# EAGLE schematic led_remote (EAGLE 6.1)
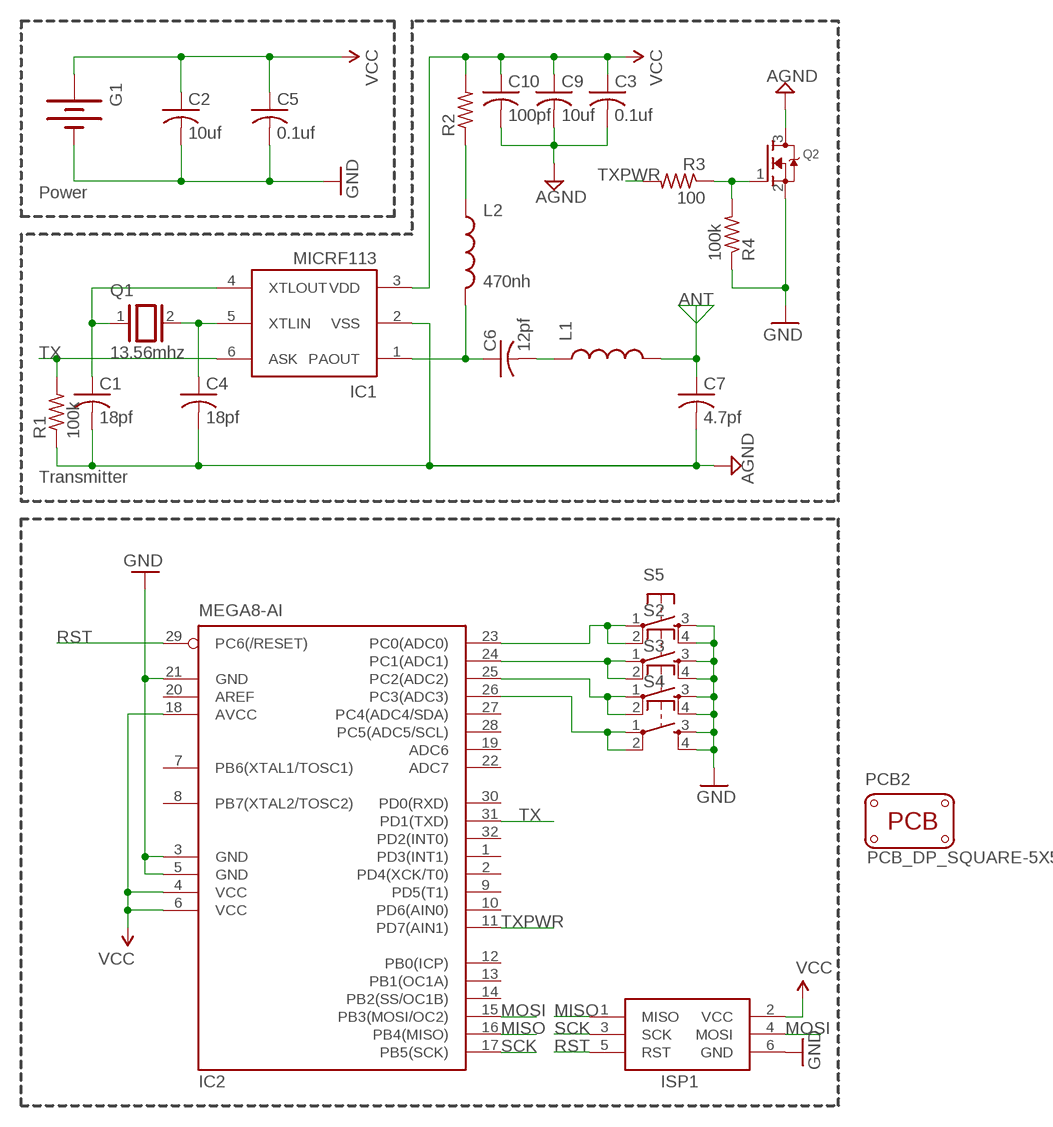
[diagram p0: schematic, sheet 1]

## Parts
C1  18pf  C-USC1206  [C1206]
C2  10uf  C-USC1206  [C1206]
C3  0.1uf  C-USC1206  [C1206]
C4  18pf  C-USC1206  [C1206]
C5  0.1uf  C-USC1206  [C1206]
C6  12pf  C-USC1206  [C1206]
C7  4.7pf  C-USC1206  [C1206]
C9  10uf  C-USC1206  [C1206]
C10  100pf  C-USC1206  [C1206]
G1  BATTERY20SMD  [BATTCON_20MM]
IC1  MICRF113  [SOT23-6]
IC2  MEGA8-AI  [TQFP32-08]
ISP1  AVRISP-6  [AVRISP]
L1  INDUCTOR1210  [1210]
L2  470nh  INDUCTOR1210  [1210]
PCB2  PCB_DP_SQUARE-5X5  [DP5050_V1]
Q1  13.56mhz  XTAL/S  [QS]
Q2  MOSFET-NREFLOW  [SOT23]
R1  100k  R-US_R1206  [R1206]
R2  R-US_R1206  [R1206]
R3  100  R-US_R1206  [R1206]
R4  100k  R-US_R1206  [R1206]
S2  TAC_SWITCHSMD  [TACTILE_SWITCH_SMD]
S3  TAC_SWITCHSMD  [TACTILE_SWITCH_SMD]
S4  TAC_SWITCHSMD  [TACTILE_SWITCH_SMD]
S5  TAC_SWITCHSMD  [TACTILE_SWITCH_SMD]

## Nets
AGND: C1.2 C3.2 C4.2 C7.2 C9.2 C10.2 IC1.2(VSS) Q2.3(D) R1.1
ANT: C7.1 L1.2
GND: C2.2 C5.2 G1.2(-) IC2.3(GND) IC2.5(GND) IC2.21(GND) ISP1.6(GND) Q2.2(S) R4.1 S2.3 S2.4 S3.3 S3.4 S4.3 S4.4 S5.3 S5.4
MISO: IC2.16(PB4(MISO)) ISP1.1(MISO)
MOSI: IC2.15(PB3(MOSI/OC2)) ISP1.4(MOSI)
N$1: L2.1 R2.1
N$2: Q2.1(G) R3.1 R4.2
N$5: C1.1 IC1.4(XTLOUT) Q1.1
N$6: C4.1 IC1.5(XTLIN) Q1.2
N$8: IC2.26(PC3(ADC3)) S4.1 S4.2
N$9: C6.1 IC1.1(PAOUT) L2.2
N$11: C6.2 L1.1
N$12: IC2.23(PC0(ADC0)) S5.1 S5.2
N$13: IC2.24(PC1(ADC1)) S2.1 S2.2
N$14: IC2.25(PC2(ADC2)) S3.1 S3.2
RST: IC2.29(PC6(/RESET)) ISP1.5(RST)
SCK: IC2.17(PB5(SCK)) ISP1.3(SCK)
TX: IC1.6(ASK) IC2.31(PD1(TXD)) R1.2
TXPWR: IC2.11(PD7(AIN1)) R3.2
VCC: C2.1 C3.1 C5.1 C9.1 C10.1 G1.1(+) IC1.3(VDD) IC2.4(VCC) IC2.6(VCC) IC2.18(AVCC) ISP1.2(VCC) R2.2
Unconnected: IC2.1(PD3(INT1)) IC2.2(PD4(XCK/T0)) IC2.7(PB6(XTAL1/TOSC1)) IC2.8(PB7(XTAL2/TOSC2)) IC2.9(PD5(T1)) IC2.10(PD6(AIN0)) IC2.12(PB0(ICP)) IC2.13(PB1(OC1A)) IC2.14(PB2(SS/OC1B)) IC2.19(ADC6) IC2.20(AREF) IC2.22(ADC7) IC2.27(PC4(ADC4/SDA)) IC2.28(PC5(ADC5/SCL)) IC2.30(PD0(RXD)) IC2.32(PD2(INT0))

## Notes on the sheet
- Power
- Transmitter

## Library data of the parts
C1-C7 C9 C10 = adafruit:C-US: CAPACITOR, American symbol
G1 = sparkfun:BATTERY: Battery Holders Various common sizes : AA, AAA, 20mm coin cell and 12mm coin cell.
IC1 = micrel:MICRF113: 300MHz to 450MHz +10dBm ASK Transmitter in SOT23
IC2 = atmel:MEGA8: MICROCONTROLLER 8 Kbytes FLASH, 1 kbytes SRAM, 512 bytes EEPROM, USART, 6-channel 10 bit ADC, 2-channel 8 bit ADC Pin compatible with Atmega48, ATMega88, ATMega168 Source: avr.lbr; MPN: ATMEGA8-16AU; OC_FARNELL: 9171371; OC_NEWARK: 73M8863
ISP1 = adafruit:AVRISP: AVR ISP HEADER Standard 6 pin header for AVR programming
L1 L2 = sparkfun:INDUCTOR: Inductors Basic Inductor/Choke - 0603 and 1206. Footprints are not proven and vary greatly between part numbers.
PCB2 = dp_devices:PCB_DP_SQUARE: Dangerous Prototypes Standard Square PCB sizes
Q1 = special:XTAL/S: CRYSTAL
Q2 = adafruit:MOSFET-N: N-Channel Mosfet 2N7002E - 60V 260mA SOT23 [Digikey: 2N7002ET1GOSTR-ND] - REEL BSH103 - 30V 850mA SOT23 [Digikey: 568-5013-1-ND]
R1-R4 = adafruit:R-US_: RESISTOR, American symbol
S2-S5 = sparkfun:TAC_SWITCH: Momentary Switch Button commonly used for reset or general input. Spark Fun Electronics SKU : COM-00097